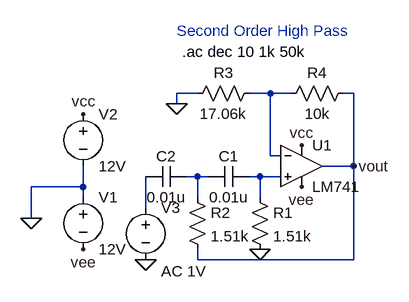
[diagram p0: schematic second_order_high_pass.asc]
second_order_high_pass.asc, the LTspice schematic file:
Version 4.1
SHEET 1 880 680
WIRE 176 32 144 32
WIRE 288 32 256 32
WIRE 320 32 288 32
WIRE 416 32 400 32
WIRE 144 48 144 32
WIRE 288 128 288 32
WIRE 304 128 288 128
WIRE 416 144 416 32
WIRE 416 144 368 144
WIRE 176 160 160 160
WIRE 192 160 176 160
WIRE 272 160 256 160
WIRE 304 160 272 160
WIRE 0 176 0 144
WIRE 0 176 -80 176
WIRE 0 192 0 176
WIRE 176 192 176 160
WIRE 272 192 272 160
WIRE 96 208 96 160
WIRE -80 224 -80 176
WIRE 176 288 176 272
WIRE 416 288 416 144
WIRE 416 288 176 288
FLAG -80 224 0
FLAG 0 64 vcc
FLAG 336 112 vcc
FLAG 336 176 vee
FLAG 0 272 vee
FLAG 96 288 0
FLAG 144 48 0
FLAG 416 144 vout
FLAG 272 272 0
SYMBOL voltage 0 176 R0
WINDOW 123 0 0 Left 0
WINDOW 39 0 0 Left 0
SYMATTR InstName V1
SYMATTR Value 12V
SYMBOL voltage 0 48 R0
WINDOW 123 0 0 Left 0
WINDOW 39 0 0 Left 0
SYMATTR InstName V2
SYMATTR Value 12V
SYMBOL LM741 336 80 R0
SYMATTR InstName U1
SYMBOL res 256 176 R0
SYMATTR InstName R1
SYMATTR Value 1.51k
SYMBOL res 160 176 R0
SYMATTR InstName R2
SYMATTR Value 1.51k
SYMBOL res 272 16 R90
WINDOW 0 0 56 VBottom 2
WINDOW 3 32 56 VTop 2
SYMATTR InstName R3
SYMATTR Value 17.06k
SYMBOL res 416 16 R90
WINDOW 0 0 56 VBottom 2
WINDOW 3 32 56 VTop 2
SYMATTR InstName R4
SYMATTR Value 10k
SYMBOL cap 256 144 R90
WINDOW 0 0 32 VBottom 2
WINDOW 3 32 32 VTop 2
SYMATTR InstName C1
SYMATTR Value 0.01u
SYMBOL cap 160 144 R90
WINDOW 0 0 32 VBottom 2
WINDOW 3 32 32 VTop 2
SYMATTR InstName C2
SYMATTR Value 0.01u
SYMBOL voltage 96 192 R0
WINDOW 123 24 114 Left 2
WINDOW 39 0 0 Left 0
SYMATTR InstName V3
SYMATTR Value ""
SYMATTR Value2 AC 1V
TEXT 144 -64 Left 2 ;Second Order High Pass
TEXT 152 -32 Left 2 !.ac dec 10 1k 50k

The netlist it stands for:
* second_order_high_pass.asc
V1 0 vee 12V
V2 vcc 0 12V
X§U1 N003 N001 vcc vee vout LM741  ; pins In+ In- V+ V- OUT
R1 N003 0 1.51k
R2 N002 vout 1.51k
R3 N001 0 17.06k
R4 vout N001 10k
C1 N003 N002 0.01u
C2 N002 N004 0.01u
V3 N004 0 AC 1V
* Second Order High Pass
.ac dec 10 1k 50k
.lib LM741.lib
.backanno
.end